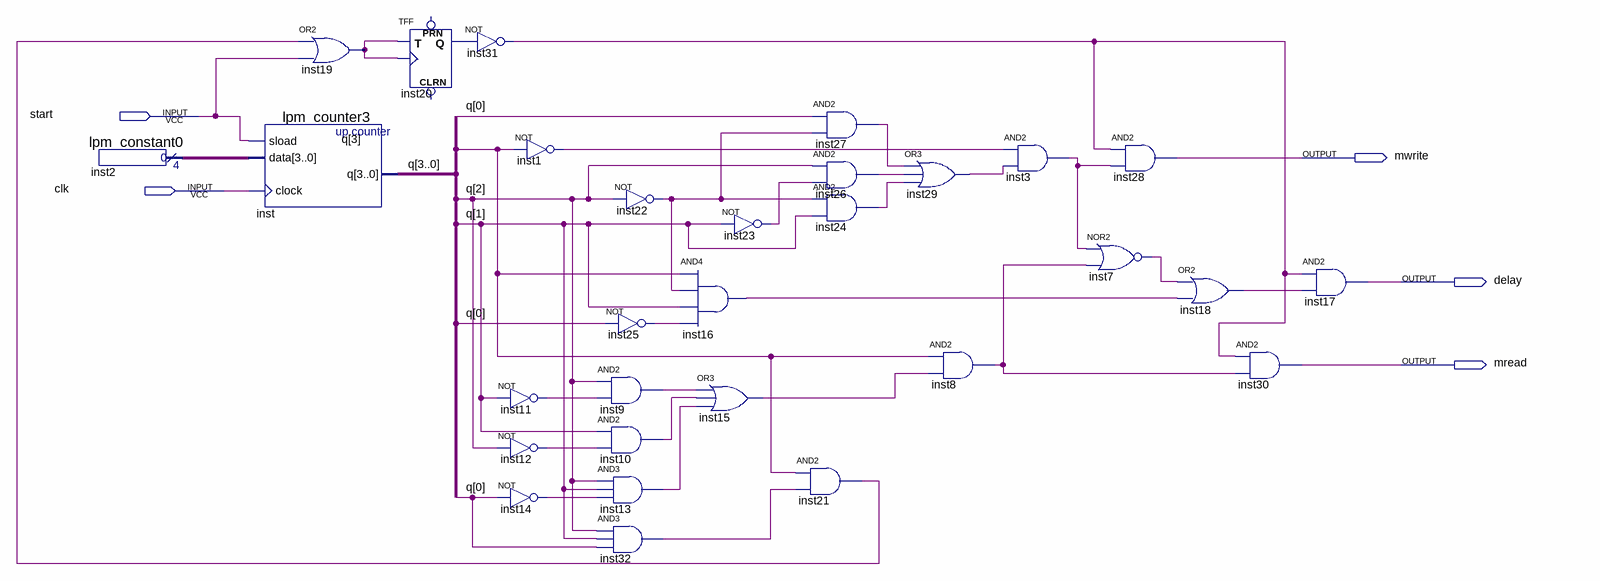
[diagram p0: schematic sheet]
// Quartus schematic control.bdf as structural Verilog: 30 symbols, 5 pins
module control (
  input  start,
  input  clk,
  output mwrite,
  output delay,
  output mread
);

  wire inst1_out, inst3_out, inst7_out, inst8_out, inst9_out, inst10_out, inst11_out, inst12_out, inst13_out,
       inst14_out, inst15_out, inst16_out, inst18_out, inst19_out, inst20_q, inst21_out, inst22_out,
       inst23_out, inst24_out, inst25_out, inst26_out, inst27_out, inst29_out, inst31_out, inst32_out;
  wire [3:0] inst2_result, q;

  lpm_constant0 inst2 (.result(inst2_result));
  lpm_counter3 inst (.sload(start), .data(inst2_result), .clock(clk), .q(q));
  or inst19 (inst19_out, inst21_out, start);
  TFF inst20 (.T(inst19_out), .CLK(inst19_out), .Q(inst20_q));  // open: PRN, CLRN
  not inst31 (inst31_out, inst20_q);
  not inst1 (inst1_out, q[3]);
  not inst11 (inst11_out, q[1]);
  not inst12 (inst12_out, q[2]);
  not inst14 (inst14_out, q[0]);
  not inst22 (inst22_out, q[2]);
  not inst25 (inst25_out, q[0]);
  and inst9 (inst9_out, q[2], inst11_out);
  and inst10 (inst10_out, q[1], inst12_out);
  and inst13 (inst13_out, q[2], q[1], inst14_out);
  and inst32 (inst32_out, q[2], q[1], q[0]);
  not inst23 (inst23_out, q[1]);
  and inst16 (inst16_out, q[3], inst22_out, q[1], inst25_out);
  or inst15 (inst15_out, inst9_out, inst10_out, inst13_out);
  and inst27 (inst27_out, q[0], inst22_out);
  and inst26 (inst26_out, q[2], inst23_out);
  and inst24 (inst24_out, inst22_out, q[1]);
  and inst21 (inst21_out, q[3], inst32_out);
  or inst29 (inst29_out, inst27_out, inst26_out, inst24_out);
  and inst8 (inst8_out, q[3], inst15_out);
  and inst3 (inst3_out, inst1_out, inst29_out);
  and inst28 (mwrite, inst31_out, inst3_out);
  nor inst7 (inst7_out, inst3_out, inst8_out);
  or inst18 (inst18_out, inst7_out, inst16_out);
  and inst30 (mread, inst31_out, inst8_out);
  and inst17 (delay, inst31_out, inst18_out);
endmodule
